# EAGLE design yBrainA1-11March2015 (EAGLE 7.2.0)
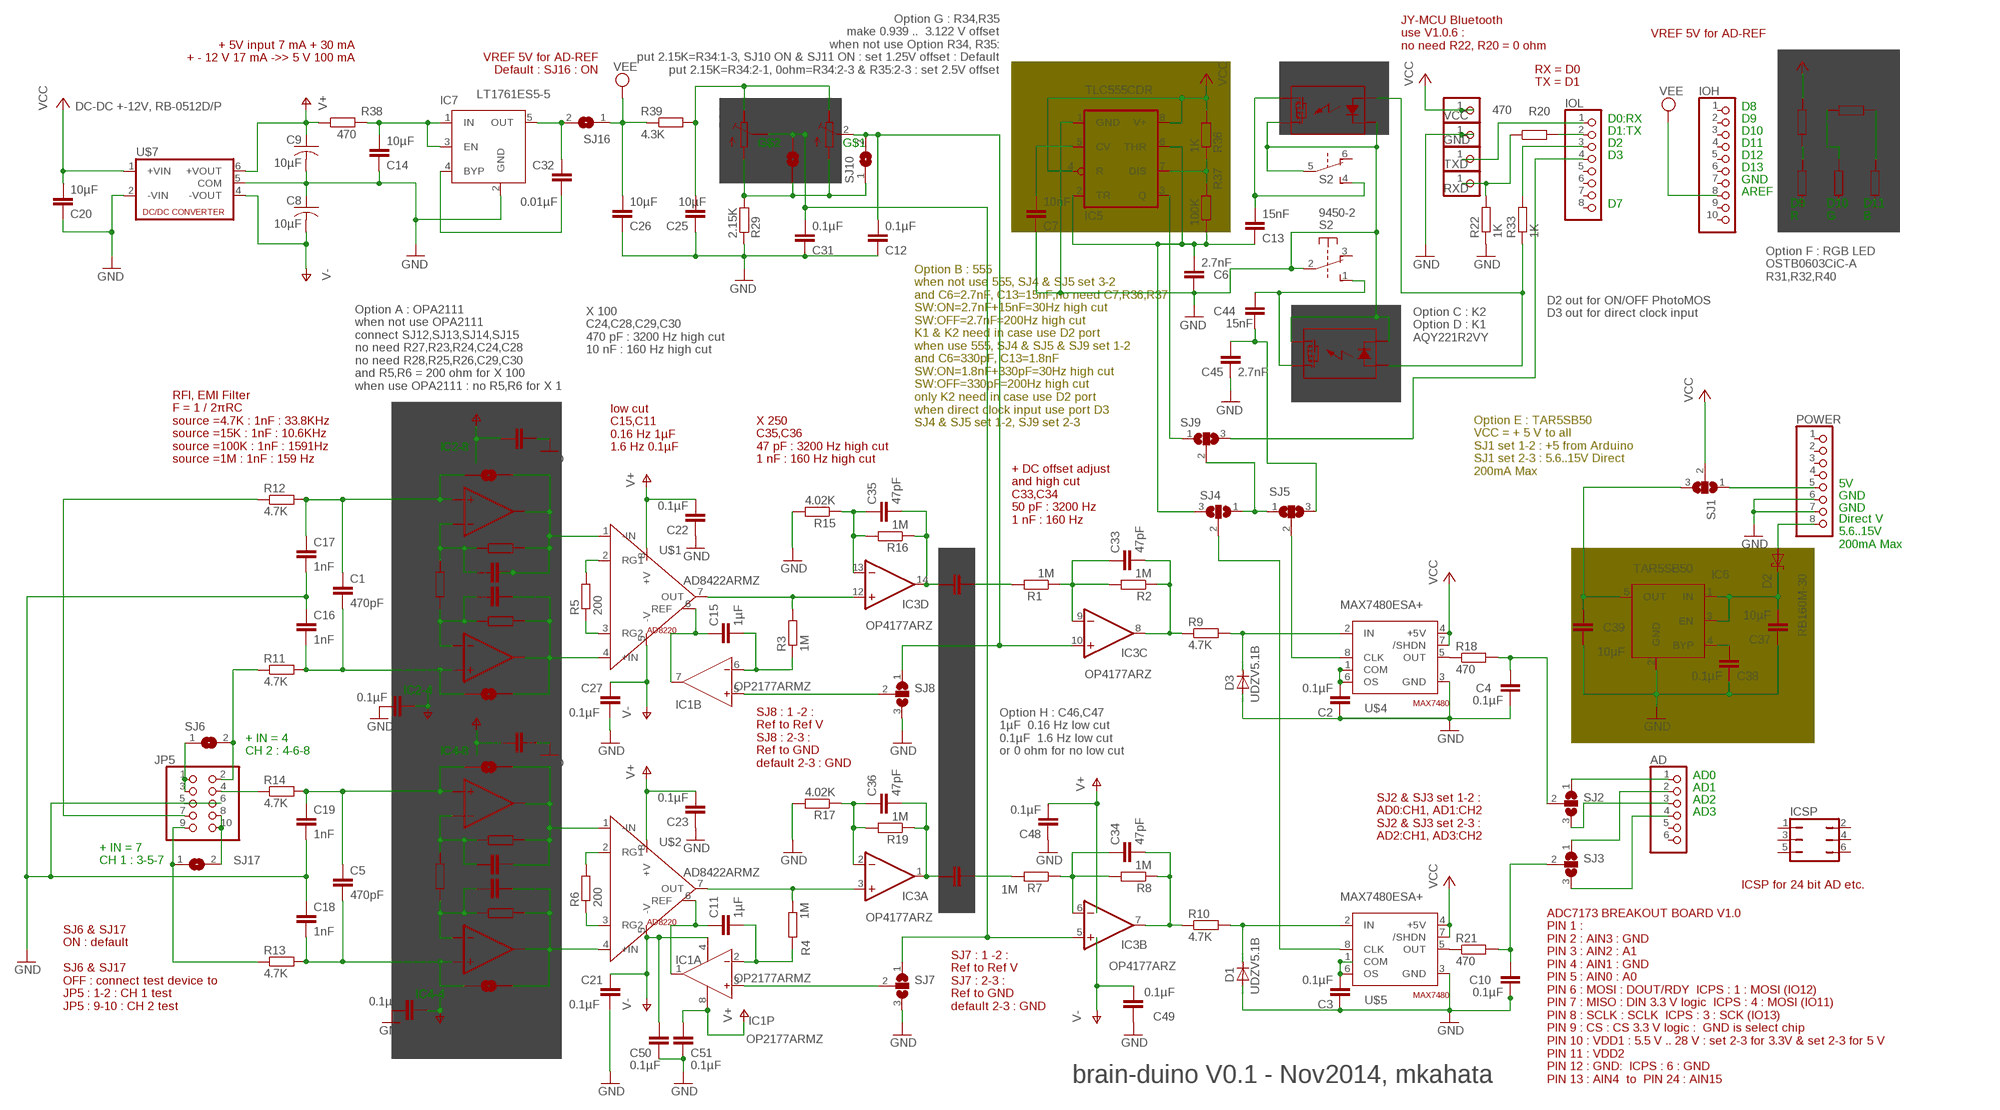
[diagram p0: schematic, sheet 1]

## Parts
AD  PINHD-1X6  [1X06]
C1  470pF  C-EUC0805  [C0805]
C2  0.1µF  C-EUC0805  [C0805]
C3  0.1µF  C-EUC0805  [C0805]
C4  0.1µF  C-EUC0805  [C0805]
C5  470pF  C-EUC0805  [C0805]
C6  2.7nF  C-EUC0805  [C0805]
C7  10nF  C-EUC0805  [C0805]
C8  10µF  C-USC0805  [C0805]
C9  10µF  C-USC0805  [C0805]
C10  0.1µF  C-EUC0805  [C0805]
C11  1µF  C-EUC0805  [C0805]
C12  0.1µF  C-EUC0805  [C0805]
C13  15nF  C-EUC0805  [C0805]
C14  10µF  C-EUC0805  [C0805]
C15  1µF  C-EUC0805  [C0805]
C16  1nF  C-EUC0805  [C0805]
C17  1nF  C-EUC0805  [C0805]
C18  1nF  C-EUC0805  [C0805]
C19  1nF  C-EUC0805  [C0805]
C20  10µF  C-EUC0805  [C0805]
C21  0.1µF  C-EUC0805  [C0805]
C22  0.1µF  C-EUC0805  [C0805]
C23  0.1µF  C-EUC0805  [C0805]
C24  470pF  C-EUC0805  [C0805]
C25  10µF  C-EUC0805  [C0805]
C26  10µF  C-EUC0805  [C0805]
C27  0.1µF  C-EUC0805  [C0805]
C28  470pF  C-EUC0805  [C0805]
C29  470pF  C-EUC0805  [C0805]
C30  470pF  C-EUC0805  [C0805]
C31  0.1µF  C-EUC0805  [C0805]
C32  0.01µF  C-EUC0805  [C0805]
C33  47pF  C-EUC0805  [C0805]
C34  47pF  C-EUC0805  [C0805]
C35  47pF  C-EUC0805  [C0805]
C36  47pF  C-EUC0805  [C0805]
C37  10µF  C-EUC0805  [C0805]
C38  0.1µF  C-EUC0805  [C0805]
C39  10µF  C-EUC0805  [C0805]
C40  0.1µF  C-EUC0805  [C0805]
C41  0.1µF  C-EUC0805  [C0805]
C42  0.1µF  C-EUC0805  [C0805]
C43  0.1µF  C-EUC0805  [C0805]
C44  15nF  C-EUC0805  [C0805]
C45  2.7nF  C-EUC0805  [C0805]
C46  1µF  C-EUC0805  [C0805]
C47  1µF  C-EUC0805  [C0805]
C48  0.1µF  C-EUC0805  [C0805]
C49  0.1µF  C-EUC0805  [C0805]
C50  0.1µF  C-EUC0805  [C0805]
C51  0.1µF  C-EUC0805  [C0805]
D1  UDZV5.1B  DIODE-SOD110-R  [SOD110-R]
D2  RB160M-30  PD3S160  [POWERDI323]
D3  UDZV5.1B  DIODE-SOD110-R  [SOD110-R]
GND  PINHD-1X1  [1X01]
IC1  OP2177ARMZ  AD8656RM  [MSOP08]
IC2  OPA2111KP  OPA2111P  [DIL08]
IC3  OP4177ARZ  TL064D  [SO14]
IC4  OPA2111KP  OPA2111P  [DIL08]
IC5  TLC555CDR  LM555D  [SO08]
IC6  TAR5SB50  MIC5219XX  [SOT23-5]
IC7  LT1761ES5-5  MIC5219XX  [SOT23-5]
ICSP  JP3Q  [JP3Q]
IOH  PINHD-1X10  [1X10]
IOL  PINHD-1X8  [1X08]
JP5  PINHD-2X5/90  [2X05/90]
K1  AQY221R2VY  AQY221R2V  [SSOP4]
K2  AQY221R2VY  AQY221R2V  [SSOP4]
POWER  PINHD-1X8  [1X08]
R1  1M  R-EU_R0805  [R0805]
R2  1M  R-EU_R0805  [R0805]
R3  1M  R-EU_R0805  [R0805]
R4  1M  R-EU_R0805  [R0805]
R5  200  R-EU_R0805  [R0805]
R6  200  R-EU_R0805  [R0805]
R7  1M  R-EU_R0805  [R0805]
R8  1M  R-EU_R0805  [R0805]
R9  4.7K  R-EU_R0805  [R0805]
R10  4.7K  R-EU_R0805  [R0805]
R11  4.7K  R-EU_R0805  [R0805]
R12  4.7K  R-EU_R0805  [R0805]
R13  4.7K  R-EU_R0805  [R0805]
R14  4.7K  R-EU_R0805  [R0805]
R15  4.02K  R-EU_R0805  [R0805]
R16  1M  R-EU_R0805  [R0805]
R17  4.02K  R-EU_R0805  [R0805]
R18  470  R-EU_R0805  [R0805]
R19  1M  R-EU_R0805  [R0805]
R20  470  R-EU_R0805  [R0805]
R21  470  R-EU_R0805  [R0805]
R22  1K  R-EU_R0805  [R0805]
R23  100K  R-EU_R0805  [R0805]
R24  100K  R-EU_R0805  [R0805]
R25  100K  R-EU_R0805  [R0805]
R26  100K  R-EU_R0805  [R0805]
R27  2K  R-EU_R0805  [R0805]
R28  2K  R-EU_R0805  [R0805]
R29  2.15K  R-EU_R0805  [R0805]
R30  LED  R-EU_R0402  [R0402]
R31  1K  R-EU_R0402  [R0402]
R32  1K  R-EU_R0402  [R0402]
R33  1K  R-EU_R0805  [R0805]
R34  10K  R-TRIMM5X  [RTRIM5X]
R35  10K  R-TRIMM5X  [RTRIM5X]
R36  1K  R-EU_R0805  [R0805]
R37  100K  R-EU_R0805  [R0805]
R38  470  R-EU_R0805  [R0805]
R39  4.3K  R-EU_R0805  [R0805]
R40  1K  R-EU_R0402  [R0402]
R41  LED  R-EU_R0402  [R0402]
RXD  PINHD-1X1  [1X01]
S2  9450-2  [9450-2]
SJ1  SJ2W  [SJ_2]
SJ2  SJ2W  [SJ_2]
SJ3  SJ2W  [SJ_2]
SJ4  SJ2W  [SJ_2]
SJ5  SJ2W  [SJ_2]
SJ6  SJ  [SJ]
SJ7  SJ2W  [SJ_2]
SJ8  SJ2W  [SJ_2]
SJ9  SJ2W  [SJ_2]
SJ10  SJ  [SJ]
SJ11  SJ  [SJ]
SJ12  SJ  [SJ]
SJ13  SJ  [SJ]
SJ14  SJ  [SJ]
SJ15  SJ  [SJ]
SJ16  SJ  [SJ]
SJ17  SJ  [SJ]
TXD  PINHD-1X1  [1X01]
U$1  AD8422ARMZ  AD8220  [AD8220]
U$2  AD8422ARMZ  AD8220  [AD8220]
U$4  MAX7480ESA+  MAX7480  [MAX7480]
U$5  MAX7480ESA+  MAX7480  [MAX7480]
U$7  DC-DC +-12V, RB-0512D/P  RB-0515D  [RB-0515D]
VCC  PINHD-1X1  [1X01]

## Nets
GND: C2.1 C3.1 C4.1 C6.1 C7.1 C8.1 C9.2 C10.1 C12.1 C14.1 C16.1 C17.2 C18.1 C19.2 C20.1 C21.2 C22.1 C23.1 C25.1 C26.1 C27.2 C31.1 C37.1 C38.1 C39.1 C40.1 C41.2 C42.2 C43.2 C45.1 C48.1 C49.1 C50.2 C51.2 D1.A D3.A GND.1 IC5.1(GND) IC6.2(GND) IC7.2(GND) JP5.5 JP5.6 K1.2(K) K1.3(DS2) K2.2(K) K2.3(DS2) POWER.6 POWER.7 R15.2 R17.2 R22.1 R29.1 S2.2(1:P) S2.5(2:P) SJ7.3 SJ8.3 U$4.3(GND) U$5.3(GND) U$7.2(-VIN) U$7.5(COM)
N$1: C4.2 R18.2 SJ2.2
N$2: C34.2 IC3.7(B:OUT) R8.1 R10.1
N$3: C47.2 R7.2
N$5: C15.2 IC1.6(B:IN-) R3.1
N$6: C24.1 IC2.2(A:-IN) R23.1 R27.2
N$7: C33.1 IC3.9(C:-IN) R1.1 R2.2
N$8: C34.1 IC3.6(B:-IN) R7.1 R8.2
N$9: D3.C R9.2 U$4.2(IN)
N$10: C10.2 R21.2 SJ3.2
N$12: D1.C R10.2 U$5.2(IN)
N$13: C28.1 IC2.6(B:-IN) R24.1 R27.1
N$14: IC3.12(D:+IN) R3.2 U$1.7(OUT)
N$15: R20.1 R22.2 RXD.1
N$16: C24.2 IC2.1(A:OUT) R23.2 SJ12.1 U$1.1(-IN)
N$17: C15.1 IC1.7(B:OUT) U$1.6(REF)
N$18: C11.1 IC1.1(A:OUT) U$2.6(REF)
N$19: C11.2 IC1.2(A:IN-) R4.1
N$20: C35.1 IC3.13(D:-IN) R15.1 R16.2
N$21: R5.1 U$1.3(RG2)
N$22: C1.2 C16.2 IC2.5(B:+IN) R11.2 SJ13.2
N$24: C28.2 IC2.7(B:OUT) R24.2 SJ13.1 U$1.4(+IN)
N$25: C5.1 C19.1 IC4.3(A:+IN) R14.2 SJ14.2
N$26: C13.2 K2.4(DS1) S2.4(2:S)
N$27: C35.2 C46.1 IC3.14(D:OUT) R16.1
N$28: JP5.8 JP5.10 SJ17.2
N$29: C5.2 C18.2 IC4.5(B:+IN) R13.2 SJ15.2
N$30: C36.1 IC3.2(A:-IN) R17.1 R19.2
N$32: C36.2 C47.1 IC3.1(A:OUT) R19.1
N$33: IOL.2 R20.2
N$34: R5.2 U$1.2(RG1)
N$35: IOL.1 TXD.1
N$36: C33.2 IC3.8(C:OUT) R2.1 R9.1
N$37: JP5.7 R12.1
N$38: AD.1 SJ2.1
N$39: C2.2 U$4.1(COM) U$4.6(OS)
N$40: C29.1 IC4.2(A:-IN) R25.1 R28.2
N$41: C3.2 U$5.1(COM) U$5.6(OS)
N$42: C30.1 IC4.6(B:-IN) R26.1 R28.1
N$43: C29.2 IC4.1(A:OUT) R25.2 SJ14.1 U$2.1(-IN)
N$44: R6.2 U$2.2(RG1)
N$45: C30.2 IC4.7(B:OUT) R26.2 SJ15.1 U$2.4(+IN)
N$46: R18.1 U$4.5(OUT)
N$47: AD.2 SJ3.1
N$48: AD.3 SJ2.3
N$49: AD.4 SJ3.3
N$50: IC3.3(A:+IN) R4.2 U$2.7(OUT)
N$51: C38.2 IC6.4(BYP)
N$52: JP5.2 R11.1 SJ6.2
N$53: IOL.3 R33.2
N$54: R6.1 U$2.3(RG2)
N$55: C1.1 C17.1 IC2.3(A:+IN) R12.2 SJ12.2
N$56: C14.2 IC7.1(IN) IC7.3(EN) R38.2
N$57: R21.1 U$5.5(OUT)
N$59: C37.2 D2.C IC6.1(IN) IC6.3(EN)
N$65: C31.2 IC3.5(B:+IN) R34.2(S) SJ7.1 SJ11.2
N$74: K1.1(A) K2.1(A) R33.1
N$75: C25.2 R34.3(A) R35.3(A) R39.2
N$77: JP5.1 JP5.3 SJ6.1
N$78: IC5.7(DIS) R36.1 R37.2
N$80: C6.2 C13.1 IC5.2(TR) IC5.6(THR) R37.1 SJ4.3
N$81: JP5.9 R13.1 SJ17.1
N$82: C32.1 IC7.4(BYP)
N$83: C7.2 IC5.5(CV)
N$84: C39.2 IC6.5(OUT) SJ1.3
N$85: POWER.5 SJ1.1
N$90: R29.2 R34.1(E) R35.1(E) SJ10.1 SJ11.1
N$91: SJ5.2 U$4.8(CLK)
N$92: SJ4.2 U$5.8(CLK)
N$94: IC5.3(Q) SJ9.1
N$95: C44.1 C45.2 SJ5.3
N$97: C44.2 K1.4(DS1) S2.1(1:S)
N$99: R31.2 R41.1
N$100: R30.2 R32.2
N$101: R30.1 R40.2
N$102: C46.2 R1.2
N$103: D2.A POWER.8
N$104: IC1.5(B:IN+) SJ8.2
N$107: C12.2 IC3.10(C:+IN) R35.2(S) SJ8.1 SJ10.2
N$108: IC1.3(A:IN+) SJ7.2
N$109: SJ4.1 SJ5.1 SJ9.2
N$113: IOL.4 SJ9.3
N$114: JP5.4 R14.1
N$119: C32.2 IC7.5(OUT) SJ16.2
V+: C9.1 C22.2 C23.2 C40.2 C42.1 C48.2 C51.1 IC1.8(P:V+) R38.1 U$1.8(+V) U$2.8(+V) U$7.6(+VOUT)
V-: C8.2 C21.1 C27.1 C41.1 C43.1 C49.2 C50.1 IC1.4(P:V-) U$1.5(-V) U$2.5(-V) U$7.4(-VOUT)
VCC: C20.2 IC5.4(R) IC5.8(V+) R36.2 R41.2 SJ1.2 U$4.4(+5V) U$4.7(/SHDN) U$5.4(+5V) U$5.7(/SHDN) U$7.1(+VIN) VCC.1
VEE: C26.2 IOH.8 R39.1 SJ16.1
Unconnected: AD.5 AD.6 ICSP.1 ICSP.2 ICSP.3 ICSP.4 ICSP.5 ICSP.6 IOH.1 IOH.2 IOH.3 IOH.4 IOH.5 IOH.6 IOH.7 IOH.9 IOH.10 IOL.5 IOL.6 IOL.7 IOL.8 POWER.1 POWER.2 POWER.3 POWER.4 R31.1 R32.1 R40.1 S2.3(1:O) S2.6(2:O)

## Notes on the sheet
- VREF 5V for AD-REF
- JY-MCU Bluetooth
  use V1.0.6 :
  no need R22, R20 = 0 ohm
- + 5V input 7 mA + 30 mA
  + - 12 V 17 mA ->> 5 V 100 mA
- VREF 5V for AD-REF
  Default : SJ16 : ON
- Option G : R34,R35
  make 0.939 ..  3.122 V offset
  when not use Option R34, R35:
  put 2.15K=R34:1-3, SJ10 ON & SJ11 ON : set 1.25V offset : Default
  put 2.15K=R34:2-1, 0ohm=R34:2-3 & R35:2-3 : set 2.5V offset
- RX = D0
  TX = D1
- D8
- D0:RX | D9
- D1:TX | D10
- G$2 | G$1 | D2 | D11
- D3 | D12
- D13
- GND
- AREF
- D7
- D9
  R
- D10
  G
- D11
  B
- Option F : RGB LED
  OSTB0603CiC-A
  R31,R32,R40
- D2 out for ON/OFF PhotoMOS
  D3 out for direct clock input
- Option C : K2
  Option D : K1
  AQY221R2VY
- X 100
  C24,C28,C29,C30
  470 pF : 3200 Hz high cut
  10 nF : 160 Hz high cut
- Option A : OPA2111
  when not use OPA2111
  connect SJ12,SJ13,SJ14,SJ15
  no need R27,R23,R24,C24,C28
  no need R28,R25,R26,C29,C30
  and R5,R6 = 200 ohm for X 100
  when use OPA2111 : no R5,R6 for X 1
- Option B : 555
  when not use 555, SJ4 & SJ5 set 3-2
  and C6=2.7nF, C13=15nF,no need C7,R36,R37
  SW:ON=2.7nF+15nF=30Hz high cut
  SW:OFF=2.7nF=200Hz high cut
  K1 & K2 need in case use D2 port
  when use 555, SJ4 & SJ5 & SJ9 set 1-2
  and C6=330pF, C13=1.8nF
  SW:ON=1.8nF+330pF=30Hz high cut
  SW:OFF=330pF=200Hz high cut
  only K2 need in case use D2 port
  when direct clock input use port D3
  SJ4 & SJ5 set 1-2, SJ9 set 2-3
- IC2-8
- low cut
  C15,C11
  0.16 Hz 1µF
  1.6 Hz 0.1µF
- RFI, EMI Filter
  F = 1 / 2πRC
  source =4.7K : 1nF : 33.8KHz
  source =15K : 1nF : 10.6KHz
  source =100K : 1nF : 1591Hz
  source =1M : 1nF : 159 Hz
- X 250
  C35,C36
  47 pF : 3200 Hz high cut
  1 nF : 160 Hz high cut
- Option E : TAR5SB50
  VCC = + 5 V to all
  SJ1 set 1-2 : +5 from Arduino
  SJ1 set 2-3 : 5.6..15V Direct
  200mA Max
- 5V
- GND
- GND
- + DC offset adjust
  and high cut
  C33,C34
  50 pF : 3200 Hz
  1 nF : 160 Hz
- Direct V
  5.6..15V
  200mA Max
- IC2-4
- + IN = 4
  CH 2 : 4-6-8
- IC4-8
- Option H : C46,C47
  1µF  0.16 Hz low cut
  0.1µF  1.6 Hz low cut
  or 0 ohm for no low cut
- SJ8 : 1 -2 : 
  Ref to Ref V
  SJ8 : 2-3 : 
  Ref to GND
  default 2-3 : GND
- AD0
- AD1
- AD2
- AD3
- SJ2 & SJ3 set 1-2 : 
  AD0:CH1, AD1:CH2
  SJ2 & SJ3 set 2-3 : 
  AD2:CH1, AD3:CH2
- + IN = 7
  CH 1 : 3-5-7
- ICSP for 24 bit AD etc.
- IC4-4
- SJ6 & SJ17
  ON : default
  
  SJ6 & SJ17
  OFF : connect test device to
  JP5 : 1-2 : CH 1 test
  JP5 : 9-10 : CH 2 test
- SJ7 : 1 -2 : 
  Ref to Ref V
  SJ7 : 2-3 : 
  Ref to GND
  default 2-3 : GND
- brain-duino V0.1 - Nov2014, mkahata
- ADC7173 BREAKOUT BOARD V1.0
  PIN 1 : 
  PIN 2 : AIN3 : GND
  PIN 3 : AIN2 : A1
  PIN 4 : AIN1 : GND
  PIN 5 : AIN0 : A0
  PIN 6 : MOSI : DOUT/RDY  ICPS : 1 : MOSI (IO12)
  PIN 7 : MISO : DIN 3.3 V logic  ICPS : 4 : MOSI (IO11)
  PIN 8 : SCLK : SCLK  ICPS : 3 : SCK (IO13)
  PIN 9 : CS : CS 3.3 V logic :  GND is select chip
  PIN 10 : VDD1 : 5.5 V .. 28 V : set 2-3 for 3.3V & set 2-3 for 5 V
  PIN 11 : VDD2
  PIN 12 : GND:  ICPS : 6 : GND
  PIN 13 : AIN4  to  PIN 24 : AIN15

## Power pins joined to a net without a drawn wire
V+: IC2.8(P:V+) IC3.4(P:V+) IC4.8(P:V+)
V-: IC2.4(P:V-) IC3.11(P:V-) IC4.4(P:V-)

## Library data of the parts
AD = pinhead:PINHD-1X6: PIN HEADER
C1-C7 C10-C51 = rcl:C-EU: CAPACITOR, European symbol
C8 C9 = rcl:C-US: CAPACITOR, American symbol
D1 D3 = diode:DIODE-: DIODE
D2 = diode:PD3S160: 1.0A SURFACE MOUNT SCHOTTKY BARRIER RECTIFIER POWERDI ® 323 Source: http://www.diodes.com/datasheets/ds30899.pdf
GND RXD TXD VCC = pinhead:PINHD-1X1: PIN HEADER
IC1 = analog-devices:AD8656: Low Noise, Precision CMOS Amplifier Source: http://www.analog.com/static/imported-files/data_sheets/AD8655_8656.pdf; MPN: AD8656ARMZ; OC_FARNELL: 1117887; OC_NEWARK: 34P3252
IC2 IC4 = linear:OPA2111: OP AMP
IC3 = linear:TL064: OP AMP
IC5 = linear:*555: TIMER
IC6 IC7 = v-reg-micrel:MIC5219XX: VOLTAGE REGULATOR; OC_FARNELL: unknown; OC_NEWARK: unknown
ICSP = jumper:JP3Q: JUMPER
IOH = pinhead:PINHD-1X10: PIN HEADER
IOL POWER = pinhead:PINHD-1X8: PIN HEADER
JP5 = pinhead:PINHD-2X5: PIN HEADER
K1 K2 = relay:AQY221*2V: PHOTOMOS Relay RF (Radio Frequency) NAiS C . R 10 SSOP Type; Source: http://www.mew-europe.com/.. aqy221_2v.pdf; MF: AROMAT/ MATSUSHITA; MPN: AQY221R2V; OC_FARNELL: 1839014; OC_NEWARK: 94C1062
R1-R33 R36-R41 = rcl:R-EU_: RESISTOR, European symbol
R34 R35 = resistor:R-TRIMM: Trimm resistor
S2 = switch-misc:9450-2: MARQUARDT SWITCH
SJ1-SJ5 SJ7-SJ9 = jumper:SJ2W: SMD solder JUMPER
SJ6 SJ10-SJ17 = jumper:SJ: SMD solder JUMPER
U$1 U$2 = MKH:AD8220: IN-AMP{
U$4 U$5 = MKH:MAX7480: Switched-Capacitor Filter
U$7 = MKH:RB-0515D: 1kVDC / 2kVDC Isolation DC-DC Converter

## Net classes
0 default: clearance 0.205 mm

## Board
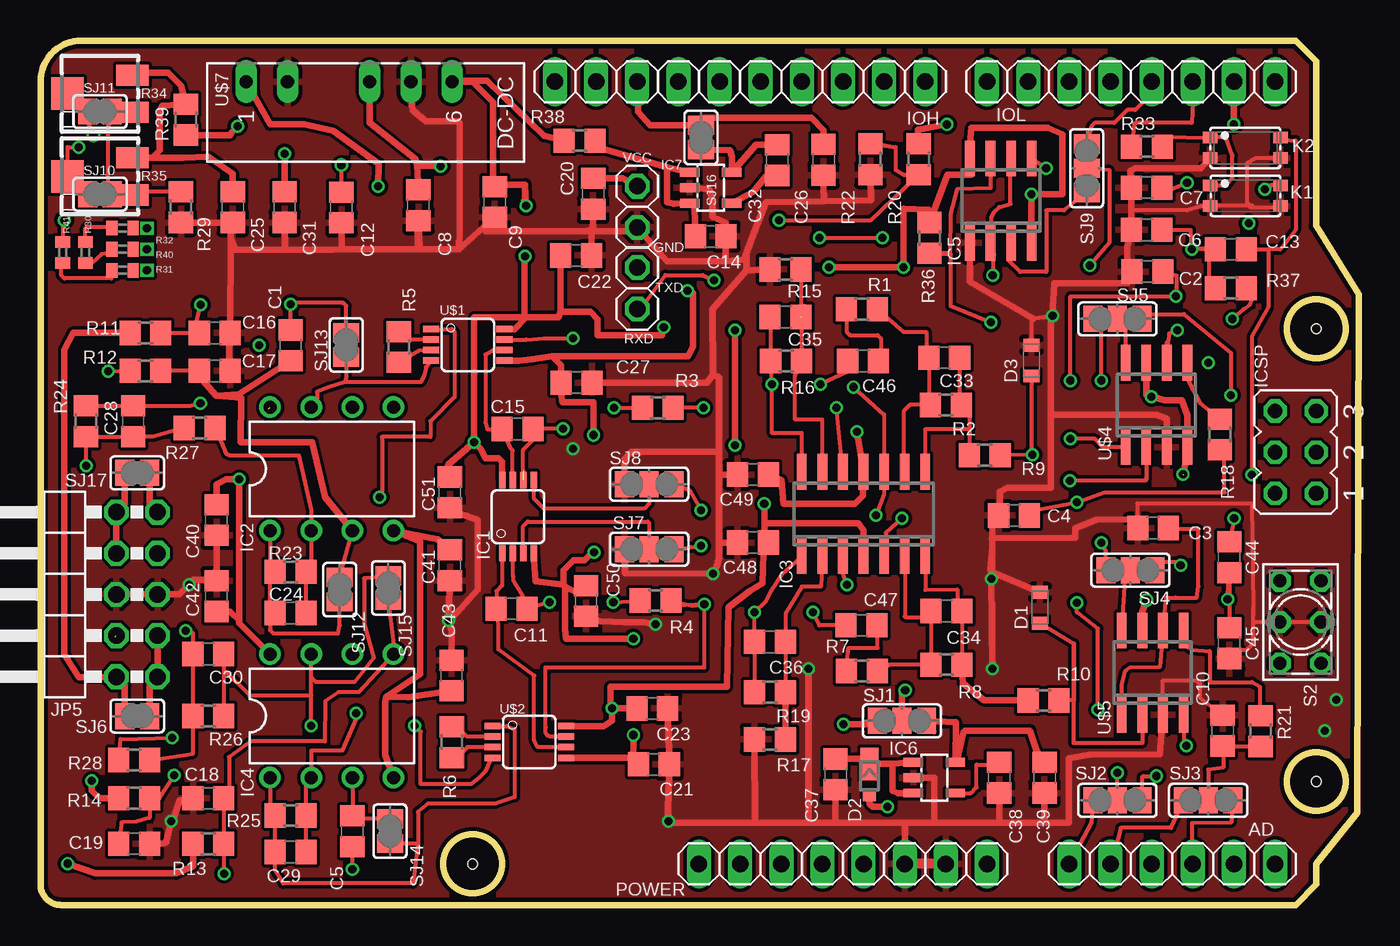
[diagram p1: board, top side]
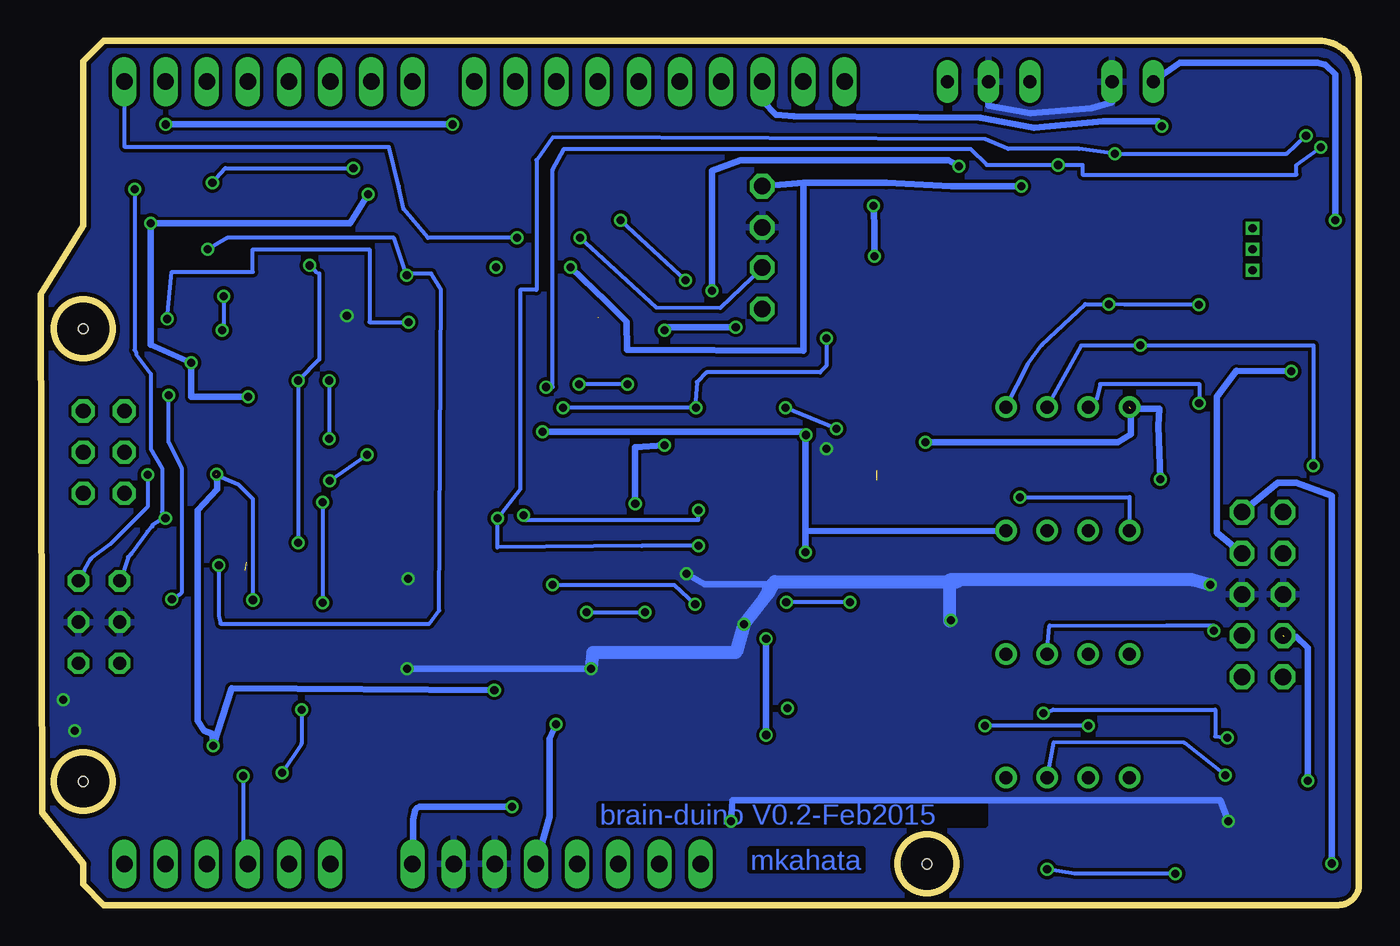
[diagram p2: board, bottom side, seen from below]

Size 81.38 x 53.34 mm. Coordinates in mm from the lower left corner, seen from the top.
Outline: 0,1.27 0,50.8 arc-90 2.54,53.34 77.47,53.34 78.74,52.07 78.74,41.91 81.38,37.7 81.28,5.68 78.74,2.54 78.74,1.27 77.47,0 1.27,0 arc-90 0,1.27
Outline: circle at 78.74,35.56 radius 1.8
Outline: circle at 78.74,7.62 radius 1.8
Outline: circle at 26.67,2.54 radius 1.8
Copper layers (1*16): Top 0.035mm / dielectric 1.5mm / Bottom 0.035mm
Design rules "BrainA1-n3 *": minimum track width 5mil, minimum drill 12mil, track to track 0.205mm, track to pad 0.205mm, pad to pad 0.205mm, via to via 0.205mm, smd to smd 0mil, copper to edge 10mil, drill to drill 10mil, minimum pad ring 10mil, minimum via ring 6mil, stop-mask expansion 2mil, vias tented up to drill 25mil, thermal gap 10mil
Holes 0.6 mm at 78.74,35.56 78.74,7.62 26.67,2.54

### Footprints (pad centres in the part's own frame; a part is rotated, then mirrored left to right if it is on the bottom)
1X06 = drill 1.016 long: 1 -6.35,0; 2 -3.81,0; 3 -1.27,0; 4 1.27,0; 5 3.81,0; 6 6.35,0
C0805 = smd 1.3 x 1.5: 1 -0.95,0; 2 0.95,0
SOD110-R = smd 0.8 x 1: A 0.95,0; C -0.95,0
POWERDI323 = smd 0.8 x 0.8: A 1.15,0 | smd 2 x 1.1: C -0.75,0
1X01 = drill 1.016 octagon: 1 0,0
MSOP08 = smd 0.4 x 1: 1 -0.976,-2.263; 2 -0.326,-2.263; 3 0.324,-2.263; 4 0.974,-2.263; 5 0.974,2.262; 6 0.324,2.262; 7 -0.326,2.262; 8 -0.976,2.262
DIL08 = drill 0.813 pad 1.27: 1 -3.81,-3.81; 2 -1.27,-3.81; 3 1.27,-3.81; 4 3.81,-3.81; 5 3.81,3.81; 6 1.27,3.81; 7 -1.27,3.81; 8 -3.81,3.81
SO14 = smd 0.6 x 2.2: 1 -3.81,-2.6; 2 -2.54,-2.6; 3 -1.27,-2.6; 4 0,-2.6; 5 1.27,-2.6; 6 2.54,-2.6; 7 3.81,-2.6; 8 3.81,2.6; 9 2.54,2.6; 10 1.27,2.6; 11 0,2.6; 12 -1.27,2.6; 13 -2.54,2.6; 14 -3.81,2.6
SO08 = smd 0.6 x 2.2: 1 -1.905,-2.6; 2 -0.635,-2.6; 3 0.635,-2.6; 4 1.905,-2.6; 5 1.905,2.6; 6 0.635,2.6; 7 -0.635,2.6; 8 -1.905,2.6
SOT23-5 = smd 0.55 x 1.2: 1 -0.95,-1.3; 2 0,-1.3; 3 0.95,-1.3; 4 0.95,1.3; 5 -0.95,1.3
JP3Q = drill 0.914 octagon: 1 -2.54,-1.27; 2 -2.54,1.27; 3 0,-1.27; 4 0,1.27; 5 2.54,-1.27; 6 2.54,1.27
1X10 = drill 1.016 long: 1 -11.43,0; 2 -8.89,0; 3 -6.35,0; 4 -3.81,0; 5 -1.27,0; 6 1.27,0; 7 3.81,0; 8 6.35,0; 9 8.89,0; 10 11.43,0
1X08 = drill 1.016 long: 1 -8.89,0; 2 -6.35,0; 3 -3.81,0; 4 -1.27,0; 5 1.27,0; 6 3.81,0; 7 6.35,0; 8 8.89,0
2X05/90 = drill 1.016 octagon: 1 -5.08,-6.35; 2 -5.08,-3.81; 3 -2.54,-6.35; 4 -2.54,-3.81; 5 0,-6.35; 6 0,-3.81; 7 2.54,-6.35; 8 2.54,-3.81; 9 5.08,-6.35; 10 5.08,-3.81
SSOP4 = smd 0.9 x 0.7: 1 -2.175,0.635; 2 -2.175,-0.635; 3 2.175,-0.635; 4 2.175,0.635
R0805 = smd 1.3 x 1.5: 1 -0.95,0; 2 0.95,0
R0402 = smd 0.7 x 0.9: 1 -0.65,0; 2 0.65,0
RTRIM5X = smd 1.3 x 2: 1 -1.15,-2; 3 1.15,-2 | smd 2 x 2: 2 0,2
9450-2 = drill 0.813 octagon: 1 -2.54,-1.27; 2 0,-1.27; 3 2.54,-1.27; 4 -2.54,1.27; 5 0,1.27; 6 2.54,1.27
SJ_2 = smd 1.168 x 1.6: 1 -1.524,0; 2 0,0; 3 1.524,0
SJ = smd 1.168 x 1.6: 1 -0.762,0; 2 0.762,0
AD8220 = smd 0.4 x 1: 1 -0.976,-2.263; 2 -0.326,-2.263; 3 0.324,-2.263; 4 0.974,-2.263; 5 0.974,2.262; 6 0.324,2.262; 7 -0.326,2.262; 8 -0.976,2.262
MAX7480 = smd 0.6 x 2.2: 1 -1.905,-2.6; 2 -0.635,-2.6; 3 0.635,-2.6; 4 1.905,-2.6; 5 1.905,2.6; 6 0.635,2.6; 7 -0.635,2.6; 8 -1.905,2.6
RB-0515D = drill 0.813 long: 1 1.27,6.35; 2 1.27,3.81; 4 1.27,-1.27; 5 1.27,-3.81; 6 1.27,-6.35

### Placement (x,y rotation side)
AD  69.85,2.54 0 top
C1  15.44,34.53 90 top
C2  68.32,39.08 0 top
C3  68.67,23.26 0 top
C4  60.09,24.04 0 top
C5  19.25,4.55 270 top
C6  68.27,41.66 0 top
C7  68.27,44.26 0 top
C8  23.33,43.18 90 top
C9  28.04,43.38 270 top
C10  72.96,10.76 270 top
C11  29.07,18.28 0 top
C12  18.58,43.04 90 top
C13  73.47,40.46 0 top
C14  41.37,41.26 180 top
C15  29.44,29.38 0 top
C16  10.76,35.3 180 top
C17  10.76,32.96 0 top
C18  10.36,6.59 0 top
C19  5.78,3.78 0 top
C20  34.11,43.88 90 top
C21  37.86,8.68 0 top
C22  33.05,40.08 180 top
C23  37.76,12.13 180 top
C24  15.44,18.02 180 top
C25  11.87,43.06 90 top
C26  48.33,45.98 90 top
C27  33.08,32.23 0 top
C28  5.72,29.85 90 top
C29  15.44,3.28 180 top
C30  10.36,15.48 0 top
C31  15.07,43.06 90 top
C32  45.47,45.96 90 top
C33  55.78,33.77 0 top
C34  55.91,18.14 0 top
C35  45.98,36.28 180 top
C36  45.02,16.24 180 top
C37  49.07,8.06 90 top
C38  59.17,7.86 90 top
C39  61.97,7.86 90 top
C40  10.87,23.76 90 top
C41  25.27,20.96 270 top
C42  10.87,19.06 90 top
C43  25.37,14.16 90 top
C44  73.37,21.46 90 top
C45  73.37,16.16 90 top
C46  50.77,33.56 0 top
C47  50.67,17.26 0 top
C48  43.97,22.36 0 top
C49  43.97,26.56 0 top
C50  33.67,18.76 270 top
C51  25.27,25.46 270 top
D1  61.69,18.34 90 top
D2  51.17,7.96 270 top
D3  61.16,33.59 90 top
GND  36.83,41.81 0 top
IC1  29.47,23.96 0 top
IC2  17.98,26.91 0 top
IC3  50.8,24.13 0 top
IC4  17.98,11.67 0 top
IC5  59.27,43.46 0 top
IC6  55.17,7.86 270 top
IC7  41.37,44.26 270 top
ICSP  77.47,27.94 90 top
IOH  43.18,50.8 180 top
IOL  67.31,50.8 180 top
JP5  0.87,19.16 90 top
K1  74.37,43.76 0 top
K2  74.36,46.72 0 top
POWER  49.53,2.54 0 top
R1  50.7,36.76 180 top
R2  55.88,30.86 180 top
R3  38.1,30.68 0 top
R4  37.96,18.78 0 top
R5  22.12,34.43 90 top
R6  25.39,10.05 90 top
R7  50.7,14.44 180 top
R8  55.91,14.83 180 top
R9  58.28,27.75 0 top
R10  61.91,12.62 0 top
R11  6.48,35.3 0 top
R12  6.48,32.96 0 top
R13  10.36,3.78 0 top
R14  5.78,6.59 0 top
R15  45.98,39.22 180 top
R16  46.02,33.56 0 top
R17  45.02,10.22 180 top
R18  72.79,29.03 270 top
R19  45.02,13.13 0 top
R20  54.2,46.02 90 top
R21  75.3,10.73 270 top
R22  51.22,46.02 90 top
R23  15.44,20.56 180 top
R24  2.81,29.85 90 top
R25  15.44,5.52 180 top
R26  10.36,11.67 0 top
R27  9.82,29.44 0 top
R28  5.78,8.94 180 top
R29  8.67,43.06 90 top
R30  2.77,40.26 90 top
R31  5.07,39.16 180 top
R32  5.07,41.76 180 top
R33  68.28,46.79 180 top
R34  3.67,50.06 90 top
R35  3.67,44.96 90 top
R36  54.87,41.16 90 top
R37  73.47,38.06 0 top
R38  33.27,47.16 0 top
R39  8.97,48.46 90 top
R40  5.07,40.46 180 top
R41  1.37,40.26 90 top
RXD  36.83,36.77 0 top
S2  77.77,17.46 270 top
SJ1  53.17,11.36 0 top
SJ2  66.47,6.46 0 top
SJ3  72.07,6.46 0 top
SJ4  67.27,20.66 0 top
SJ5  66.47,36.16 0 top
SJ6  5.97,11.66 180 top
SJ7  37.57,21.96 180 top
SJ8  37.57,25.96 180 top
SJ9  64.57,45.46 90 top
SJ10  3.67,43.86 180 top
SJ11  3.67,48.96 180 top
SJ12  18.47,19.46 90 top
SJ13  18.87,34.56 90 top
SJ14  21.57,4.56 90 top
SJ15  21.47,19.56 270 top
SJ16  40.77,47.36 270 top
SJ17  5.97,26.66 180 top
TXD  36.83,39.33 0 top
U$1  26.37,34.56 270 top
U$2  30.17,10.06 270 top
U$4  68.88,30.86 0 top
U$5  68.64,14.34 0 top
U$7  19.05,49.53 90 top
VCC  36.83,44.35 0 top

### Tracks (layer width: path | path; a pad name or v marks a point on that pad's centre or on a via)
GND  (via drill 0.5)
  Top 0.254: 9.09,6.59 C18.1 9.37,6.55 | 58.74,22.02 58.72,23.44 C4.1 | 11.63,35.48 C16.1 | 11.63,33.58 C17.2 | v62.47,36.36 61.27,36.16 | 61.27,36.16 61.17,36.1 D3.A | 62.37,36.26 61.27,36.16 | 67.07,38.36 67.25,38.66 C2.1 | IC5.1 57.57,41.06 57.57,41.16 | 25.87,48.26 25.77,48.36 | 23.77,48.36 23.67,48.46 | 15.09,40.43 15.15,40.43 | 18.58,40.53 18.07,40.42 | 67.73,23.29 67.7,24.76 74.77,24.76 74.86,18.36 | 58.77,22.53 58.64,20.66 | U$5.3 69.28,13.87 70.27,13.86 71.27,13.86 71.57,13.66 71.57,12.8 C10.1 73.17,11.92 | 67.32,42.86 70.77,42.86 71.63,43.12 K1.2 72.33,43.16 74.47,43.16 74.47,43.36 | 72.09,45.94 72.19,46.03 K2.2 | 74.86,18.36 74.87,17.89 | C45.1 73.37,15.76 74.47,15.76 74.87,16.16 74.87,17.36 | 24.82,19.46 C41.2 | K2.3 75,46.09 74.47,45.76 74.47,43.36 | 74.47,43.36 74.77,43.16 74.67,43.06 76.58,43.06 K1.3 | 74.87,17.36 74.87,18.35 74.86,18.36 | S2.5 S2.2 74.97,17.46 74.87,17.36 | 38.59,5.26 38.77,5.08 | 34,41.49 34.07,41.56 | 25.17,17.59 v25.2,17.56
  Top 0.305: 11.66,42.01 11.64,41.93
  Top 0.406: R17.2 44.11,5.12 38.71,5.08 | 38.71,5.08 C21.2 C23.1 | 61.97,5.08 63.46,5.08 63.46,9.06 64.74,9.26 69.07,9.29 U$5.3 | 61.97,5.08 59.17,5.08 | 59.17,5.08 55.17,5.08 | 55.17,5.08 53.34,5.08 | 53.34,5.08 49.07,5.08 | 49.07,5.08 47.4,5.08 | 47.4,5.08 38.77,5.08 38.71,5.08 | POWER.6 53.34,5.08 | D1.A 58.75,20.54 v58.69,20.14 | v58.69,20.14 v58.75,14.59 | C4.1 59.22,24.66 59.22,25.51 59.67,25.76 62.37,25.76 62.37,30.26 | v58.69,20.14 58.75,21.79 58.74,23.18 58.74,22.02 58.64,20.66 | 23.4,40.46 25.84,40.46 | 25.84,40.46 C9.2 27.5,42.23 27.47,41.56 33.67,41.56 | v47.4,14.59 47.4,5.08 | C3.1 67.73,23.29 67.44,23.79 65.17,23.76 63.87,23.26 63.87,22.66 63.62,22.65 58.73,22.63 58.77,22.53 | 11.73,41.16 12.03,40.42 15.08,40.42 C31.1 | 11.73,41.16 C16.1 | 11.63,35.48 11.63,33.58 | 23.4,40.46 C8.1 23.27,41.83 23.27,40.56 | C31.1 15.09,40.43 18.07,40.42 18.67,40.46 23.27,40.46 | C31.1 15.11,42.11 | 11.64,41.93 11.57,41.96 | IC5.1 57.37,38.46 61.27,36.16 | 62.37,30.26 62.37,30.46 | 62.37,30.46 62.37,36.26 | U$4.3 69.51,30 68.87,30.26 62.37,30.26 | 62.37,30.26 62.47,30.16 62.37,30.46 | 41.87,27.96 41.87,32.56 41.51,32.71 | 41.87,27.96 41.87,26.56 | 41.87,26.56 41.87,22.36 | 41.87,22.36 41.87,21.36 41.73,20.86 v41.5,20.43 36.07,20.46 SJ7.3 | 41.51,32.71 41.47,36.76 43.57,39.16 | 43.57,39.16 43.97,39.16 R15.2 | 42.27,39.71 38.67,39.71 GND.1 36.68,41.76 36.17,41.56 34.07,41.56 33.67,41.56 | 42.27,39.71 43.42,39.81 | 43.42,39.81 43.97,41.31 44.77,43.36 48.36,43.41 | 43.42,39.81 43.57,40.16 43.57,39.16 | R22.1 51.27,43.47 48.36,43.41 | 72.13,45.98 72.09,45.94 71.61,45.46 67.57,45.46 67.27,45.31 C7.1 67.32,42.86 C6.1 67.07,40.61 67.07,38.36 62.57,38.36 v62.47,36.36
  Top 0.406: 23.4,40.46 23.27,40.56 | 23.27,40.56 23.27,40.46 | 23.4,40.46 23.27,40.46 | 23.4,40.56 23.4,40.46 | 25.87,48.26 25.87,41.64 25.84,40.46 | 25.77,48.36 23.77,48.36 | 23.67,48.46 22.97,49.05 22.86,49.96 U$7.5 | 42.27,39.71 C14.1 42.27,42.11 41.47,42.46 41.47,43.26 41.37,43.86 41.27,44.16 IC7.2 | C12.1 18.58,40.53 | C25.1 11.66,42.01 | C25.1 11.78,41.91 11.73,41.16 | C26.1 48.33,44.44 48.36,43.41 | C20.1 34.11,41.72 33.67,41.56 | C37.1 49.07,5.08 | IC6.2 55.17,7.86 55.17,5.08 | C39.1 61.97,5.08 | v25.2,17.56 25.4,16.79 | C43.2 25.37,16.99 v25.2,17.56 | R29.1 C25.1 | C40.1 10.87,20.76 10.67,20.06 9.47,20.06 | 9.47,20.06 v9.17,19.76 8.57,19.16 JP5.5 JP5.6 | 9.47,20.06 9.42,20.06 C42.2 | C38.1 59.17,5.08 | C19.2 7.63,3.82 7.77,3.86 v8.07,5.16 8.17,5.16 8.59,6.48 9.09,6.59 | v38.77,5.16 38.59,5.26 | C22.1 34,41.49 | C27.2 41.13,32.23 41.51,32.71 | SJ8.3 36.05,27.54 36.47,27.96 41.87,27.96 | C49.1 41.87,26.56 | C48.1 41.87,22.36 | C51.2 24.82,24.51 26.97,23.76 26.97,19.46 25.37,17.66 25.3,17.56 v25.2,17.56 | C50.2 34.52,17.51 36.07,17.46 37.22,17.46 v37.96,17.32 | C41.2 25.17,17.59
  Top 0.61: POWER.7 POWER.6
  Bottom 0.254: 8.12,5.21 v8.07,5.16
  Bottom 0.406: v58.75,14.59 v47.4,14.59 | U$7.5 22.86,49.33 20.29,48.86 16.51,49.16 15.24,49.53 U$7.2 | v41.5,20.43 40.4,19.79 36.43,19.79 v37.96,17.32 | v38.77,5.16 38.67,6.46 8.57,6.46 v8.07,5.16
  Bottom 0.813: v47.4,14.59 47.3,15.57 38.46,15.57 v37.96,17.32 36.47,19.22 36.07,19.96 | 36.47,19.56 36.07,19.96 | 36.07,19.96 24.77,19.96 | v9.17,19.76 10.27,20.06 25.27,20.06 25.27,17.53 v25.2,17.56
  other vias: 79.97,12.66 79.27,10.76 32.87,28.16
  pour Top: 0,53.34 0,0 81.28,0 81.28,53.34
  pour Bottom: 0,41.91 0,0 81.28,0 81.28,53.34 0,53.34
N$1  (via drill 0.5)
  Top 0.254: C4.2 61.15,24.34 v63.97,24.86 65.67,25.46 73.07,25.46 73.07,28.36 R18.2 | SJ2.2 v66.47,8.16 | v65.27,12.06 65.27,17.06 63.97,18.06 v63.97,18.66
  Bottom 0.254: v63.97,24.86 v63.97,18.66 | v65.27,12.06 65.27,9.96 v66.47,8.16
N$2
  Top 0.254: IC3.7 54.61,19.45 56.58,19.48 56.58,17.96 C34.2 R8.1 56.68,14.43
  Top 0.406: R10.1 58.24,12.64 56.94,13.69 56.86,14.54 R8.1 | 56.86,14.15 56.68,14.43
N$3
  Top 0.254: R7.2 49.85,15.64 49.87,15.86 51.67,15.86 51.67,17.21 C47.2
N$5  (via drill 0.5)  (1 unrouted)
  Top 0.254: v32.25,29.38 C15.2 30.57,29.2 30.57,28.76 30.47,28.76 29.79,28.08 29.79,26.81 | v35.39,30.68 R3.1
  Bottom 0.254: v32.25,29.38 v35.39,30.68
N$6
  Top 0.254: C24.1 R23.1 16.71,20.88 IC2.2 16.71,24.37 15.94,27.74 13.47,27.76 11.67,27.76 11.47,27.84 R27.2
N$7
  Top 0.254: R1.1 53.27,35.36 54.67,35.36 54.67,33.26 54.77,33.16 54.77,33.71 C33.1 54.83,30.96 R2.2 53.67,30.86 53.27,30.46 53.27,26.8 IC3.9
N$8
  Top 0.254: IC3.6 53.34,17.79 53.37,17.76 54.84,17.76 C34.1 R8.2 52.44,14.83 R7.1
N$9  (via drill 0.5)
  Top 0.254: U$4.2 68.25,26.31 68.21,26.18 v63.54,26.18 | D3.C 61.15,28.12 v61.22,27.78 R9.2
  Bottom 0.254: v63.54,26.18 v61.22,27.78
N$10
  Top 0.254: R21.2 72.99,9.78 | 72.99,9.78 C10.2 | 72.99,9.78 72.99,8.48 72.07,8.36 SJ3.2
N$12
  Top 0.254: 63.79,16.13 63.79,12.62 R10.2 | U$5.2 68,9.99 63.77,9.99 63.77,11.46 63.79,16.13 | 63.79,16.13 D1.C
N$13  (via drill 0.5)
  Top 0.254: v2.81,27.11 R24.1 C28.1 6.97,28.9 R27.1
  Bottom 0.254: v2.81,27.11 2.81,34.53 v13.5,34.53 17.15,34.53 IC2.6
N$14  (via drill 0.5)
  Top 0.254: IC3.12 v49.13,30.68 | R3.2 v40.91,30.68 40.97,30.64 | v32.87,34.96 31.07,34.96 31.06,34.96 29.99,34.89 U$1.7
  Bottom 0.254: v49.13,30.68 v40.91,30.68 40.97,30.72 40.87,32.26 40.27,32.86 33.27,32.86 32.87,33.26 v32.87,34.96
N$15  (via drill 0.5)
  Top 0.254: R22.2 52.77,46.76 | 51.67,46.96 52.77,46.76 | 52.77,46.76 52.77,45.36 53.27,45.07 R20.1 54.07,44.94 51.27,42.26 v45.57,42.26 | RXD.1 36.98,36.67 38.57,38.86 40.87,38.86 v41.57,38.56
  Bottom 0.254: v45.57,42.26 v41.57,38.56
N$16  (via drill 0.5)
  Top 0.254: IC2.1 14.17,20.88 R23.2 14.17,20.56 14.17,18.02 | C24.2 14.17,18.02 | v20.93,25.17 21.07,25.56 21.07,28.88 24.07,28.88 24.07,29.86 25.57,31.36 25.57,35.36 25.39,35.54 U$1.1 | 14.17,18.02 14.17,16.96 14.37,16.76 18.37,16.76 18.47,17.26 SJ12.1
  Bottom 0.254: v20.93,25.17 14.17,25.17 IC2.1
N$17
  Top 0.254: U$1.6 27.95,34.24 27.47,33.96 27.47,29.76 27.57,29.36 28.47,29.36 C15.1 29.01,28.2 29.14,28.06 IC1.7
N$18
  Top 0.254: U$2.6 30.69,9.74 30.47,10.16 30.47,14.16 28.27,15.76 28.27,17.29 28.2,17.66 C11.1 28.13,19.36 28.49,19.72 IC1.1
N$19  (via drill 0.5)
  Top 0.254: v35.35,18.68 R4.1 | v31.41,18.68 C11.2 29.7,19.2 29.17,20.03 29.17,20.26 29.14,20.29 IC1.2
  Bottom 0.254: v31.41,18.68 v35.35,18.68
N$20  (1 unrouted)
  Top 0.254: IC3.13 48.26,29.95 46.57,29.95 46.57,32.66 R16.2 46.97,36.06 | 46.67,36.46 46.67,36.56 46.97,36.96 47.17,36.96 46.87,36.86 46.97,36.92 C35.1 | R15.1 46.93,36.1 46.97,36.06 | 46.97,36.06 46.97,36.26
N$21
  Top 0.254: R5.1 23.34,34.2 24.08,34.24 U$1.3
N$22  (via drill 0.5)
  Top 0.254: R11.2 C16.2 9.61,35.89 v9.89,37.04 | C1.2 v15.44,37.07 15.53,37.16 18.67,37.16 18.87,36.96 SJ13.2
  Bottom 0.254: v9.89,37.04 14.47,37.04 v15.44,37.07 16.89,37.07 19.57,34.56 20.41,33.42 IC2.5
N$24  (via drill 0.5)
  Top 0.254: U$1.4 23.8,33.19 23.67,32.66 23.47,32.26 18.77,32.26 | 18.77,32.26 17.77,31.96 17.07,31.66 17.07,31.08 IC2.7 | SJ13.1 18.87,32.56 18.77,32.26 | R24.2 C28.2 | C28.2 9.21,30.8 v9.87,30.96
  Top 0.406: C28.2
  Bottom 0.254: IC2.7 16.17,31.26 15.97,32.16 9.87,32.16 v9.87,30.96
N$25  (via drill 0.5)
  Top 0.254: v8.25,8 7.33,6.58 R14.2 6.73,5.37 5.91,5.15 5.01,5.1 C19.1 | IC4.3 C5.1 19.43,5.32 SJ14.2
  Bottom 0.254: v8.25,8 10.78,10 18.85,10.03 IC4.3
N$26  (via drill 0.5)
  Top 0.254: K2.4 76.38,47.25 77.47,47.16 77.47,41.66 76.52,40.46 75.77,40.46 | C13.2 75.77,40.46 | 75.77,40.46 75.77,36.86 74.77,35.06 v74.77,26.56
  Bottom 0.254: v74.77,26.56 74.77,24.56 77.07,22.26 78.27,21.36 78.67,20.66 78.87,20.17 S2.4
N$27  (via drill 0.5)
  Top 0.254: IC3.14 46.99,29.11 45.15,29.11 v45.15,32.12 45.05,33 | C35.2 45.19,36.58 45.17,36.76 44.97,36.76 45.07,36.66 R16.1 | C46.1 49.82,32.91 v48.13,32.12
  Top 0.406: 45.05,33 44.97,33.9 R16.1 44.85,33.66
  Bottom 0.254: v45.15,32.12 v48.13,32.12
N$28
  Top 0.406: SJ17.2 5.21,24.77 JP5.10 JP5.8
N$29  (via drill 0.5)
  Top 0.254: v11.33,1.94 11.31,2.26 R13.2 C18.2 11.63,6.91 11.63,9.13 13,10.1 17.55,10.1 17.57,12.56 18.39,13.14 19.65,13.14 IC4.5 21.87,15.56 SJ15.2 | v19.25,2.21 C5.2
  Bottom 0.254: v11.33,1.94 17.55,1.94 v19.25,2.21
N$30
  Top 0.254: IC3.2 48.16,19.65 46.99,19.65 45.99,17.96 C36.1 R19.2
  Top 0.406: R17.1 R19.2
N$32  (via drill 0.5)
  Top 0.254: IC3.1 45.78,20.42 45.12,19.42 44.77,18.73 v44.07,18.06 C36.2 R19.1 | C47.1 48.07,17.26 v47.67,18.06
  Bottom 0.254: v47.67,18.06 v44.07,18.06
N$33  (via drill 0.5)
  Top 0.406: R20.2 54.17,47.82 v55.94,48.16 | v73.66,48.16 IOL.2
  Bottom 0.406: v55.94,48.16 v73.66,48.16
N$34
  Top 0.254: R5.2 22.23,35.36 22.61,34.89 U$1.2
N$35  (via drill 0.5)
  Top 0.254: v48.07,41.16 v51.97,41.16
  Bottom 0.254: TXD.1 39.44,36.83 43.37,36.86 v48.07,41.16 | v51.97,41.16 57.47,41.16 58.97,42.96 59.27,44.36 59.87,46.76 76.17,46.76 76.17,50.77 IOL.1
N$36
  Top 0.254: IC3.8 54.61,29.35 56.87,29.36 57.37,29.36 57.37,27.75 R9.1 57.33,30.65 R2.1 56.73,30.96 C33.2
N$37  (via drill 0.5)
  Top 0.254: v4.17,32.93 R12.1
  Bottom 0.406: JP5.7 8.77,22.96 8.77,31.36 7.57,32.96 v4.17,32.93
N$38
  Top 0.254: SJ2.1 64.85,5.09 AD.1
N$39  (via drill 0.5)
  Top 0.254: U$4.1 65.57,28.26 65.07,28.76 v63.57,28.76 | v63.57,32.36 63.57,37.56 v70.07,37.56 70.12,38 70.12,38.84 C2.2 | v70.17,35.46 69.67,35.26 69.57,34.76 | 69.57,34.76 69.57,33.7 U$4.6 69.51,34.7 69.57,34.76
  Bottom 0.254: v63.57,32.36 v63.57,28.76 | v70.07,37.56 70.07,35.86 v70.17,35.46
N$40  (via drill 0.5)
  Top 0.254: C29.1 R25.1 16.39,7.54 IC4.2 16.71,9.53 18.62,9.53 19.49,11.5 v19.49,11.84 | R28.2 4.95,10.24 v8.12,10.31
  Bottom 0.254: v19.49,11.84 19.22,11.91 18.87,12.06 8.87,12.06 8.87,10.41 v8.12,10.31
N$41
  Top 0.254: U$5.1 66.74,13.6 66.97,14.44 67.24,14.64 69.07,14.67 U$5.6 69.47,18.96 70.07,18.96 71.37,18.96 71.47,19.66 71.47,23.18 70.14,23.19 70.14,23.76 C3.2
N$42  (via drill 0.5)
  Top 0.254: v8.96,16.92 9.41,16.77 C30.1 R26.1 9.41,9.34 R28.1
  Bottom 0.254: v8.96,16.92 v8.97,16.92 8.97,17.26 11.87,17.26 19.11,17.24 IC4.6
N$43
  Top 0.254: IC4.1 14.17,5.64 R25.2 C29.2 14.47,2.16 14.97,1.34 22.99,1.34 23.3,3.86 | 23.3,3.86 23.3,5.75 23.91,6.26 28.07,6.26 29.27,6.66 29.27,10.86 28.79,11.04 U$2.1 | SJ14.1 23.16,3.8 23.3,3.86
N$44
  Top 0.254: U$2.2 26.34,10.39 25.77,10.96 25.53,10.96 R6.2
N$45  (via drill 0.5)
  Top 0.254: R26.2 C30.2 11.31,14.53 12.9,12.94 16.71,12.94 | 16.71,12.94 16.71,14.06 | 16.71,14.06 IC4.7 | v16.71,11.07 16.71,12.94 | U$2.4 27.8,9.09 27.47,8.26 27.07,7.86 26.57,7.46 23.47,7.46 23.47,10.7 v23.1,11.07 | SJ15.1 20.83,20.22 20.07,20.16 19.97,20.16 19.97,17.36 20.57,15.26 19.37,13.76 17.01,13.76 16.71,14.06
  Bottom 0.254: v16.71,11.07 v23.1,11.07
N$46
  Top 0.254: U$4.5 70.77,32.46 71.57,30.98 R18.1
N$47
  Top 0.254: SJ3.1 69.77,4.76 66.67,4.76 66.27,3.21 AD.2
N$48  (via drill 0.5)
  Top 0.254: SJ2.3 67.99,7.88 68.07,7.96 v68.87,7.96
  Bottom 0.254: v68.87,7.96 68.87,3.13 AD.3
N$49
  Top 0.254: SJ3.3 73.49,5.08 71.07,5.06 71.07,2.59 AD.4
N$50  (via drill 0.5)
  Top 0.254: v40.97,18.56 40.97,14.66 31.17,14.66 31.17,11.76 31.17,10.96 31.17,10.65 31.27,10.46 31.44,10.39 U$2.7 | v40.97,18.56 39.23,18.46 R4.2 40.25,18.48 v40.97,18.56 | 49.75,19.74 v49.77,19.76 49.47,20.66 49.37,20.76 49.37,21.37 IC3.3
  Bottom 0.254: v49.77,19.76 42.27,19.76 v40.97,18.56
N$51
  Top 0.254: IC6.4 57.42,6.91 57.77,7.26 57.77,8.66 59.02,8.66 C38.2
N$52
  Top 0.406: SJ6.2 5.21,13.55 JP5.2 4.66,14.06 2.37,14.06 1.47,15.46 1.47,34.26 2.01,35.3 R11.1
N$53
  Top 0.254: 67.41,46.79 R33.2 67.51,48.21 67.61,48.26 71.05,48.26 71.12,49.53 IOL.3
N$54
  Top 0.254: U$2.3 26.35,9.74 25.77,9.16 25.65,9.26 R6.1
N$55
  Top 0.254: C17.1 R12.2 | SJ12.2 19.27,23.08 IC2.3
  Top 0.406: C1.1 12.23,31.52 10.83,31.41 | 10.83,31.41 9.56,32.91 C17.1 | IC2.3 19.27,23.1 17.57,25.16 16.77,28.56 12.35,28.54 12.38,31.31 10.83,31.41
N$56
  Top 0.254: 34.37,46.66 34.47,46.66 34.37,46.76 34.47,46.76 R38.2 34.47,46.71
  Top 0.406: IC7.1 38.67,45.51 | 38.67,45.51 34.47,46.71 | 39.07,43.26 39.12,43.26 | 39.12,43.26 IC7.3 40.37,43.01 C14.2 | 39.12,43.26 38.67,43.36 38.67,45.51
N$57
  Top 0.254: U$5.5 70.84,15.88 71.07,15.76 72.17,15.66 72.17,13.76 74.77,13.76 75.27,13.46 75.27,11.81 R21.1
N$59
  Top 0.254: 50.97,9.01 D2.C | 53.77,8.81 IC6.1
  Top 0.406: C37.2 50.97,9.01 | D2.C 52.57,8.71 | 52.57,8.71 53.77,8.81 | IC6.3 52.92,6.91 52.57,7.06 52.57,8.71
N$65  (via drill 0.5)
  Top 0.254: v3.27,47.46 2.47,49.26 1.67,49.36 | v53.17,23.86 52.17,22.96 52.17,21.63 | 52.17,21.56 52.17,21.63 | 52.17,21.63 IC3.5 | SJ7.1 40.15,22.08 v40.77,22.16 | R34.2 1.67,49.36 | SJ11.2 2.87,49.06 2.57,49.36 1.67,49.36
  Top 0.406: C31.2 v15.07,46.36
  Bottom 0.254: v3.27,47.46 4.47,46.36 v15.07,46.36 17.27,46.66 21.67,46.66 23.07,47.26 49.77,47.36 50.77,45.96 50.77,37.96 51.77,37.96 51.77,25.66 v53.17,23.86 53.17,22.06 44.27,22.16 v40.77,22.16
N$74
  Top 0.254: R33.1 69.25,47.39 K2.1 73.17,47.36 73.57,46.26 73.57,44.86 73.21,44.39 K1.1
N$75
  Top 0.254: 5.72,51.36 R34.3 | 6.97,46.16 5.72,46.16 R35.3
  Top 0.406: 5.72,51.36 7.87,51.36 8.67,50.56 R39.2 7.52,49.31 7.37,48.96 7.37,46.56 6.97,46.16 | R35.3 8.82,46.11 10.37,46.16 11.87,45.11 C25.2
N$77
  Top 0.406: SJ6.1 6.73,13.59 JP5.1 JP5.3
N$78  (via drill 0.5)
  Top 0.254: IC5.7 58.63,44.23 56.57,44.16 56.17,42.66 56.12,40.26 R36.1 56.17,40.16 56.17,36.96 v58.67,35.96 58.57,35.96 | 74.87,37.56 74.77,37.66 74.82,37.71 74.87,37.56 | 74.87,37.71 74.87,37.61 | v73.57,36.16 74.27,36.76 74.67,37.06 74.87,37.56 | 74.87,37.56 74.87,37.61 | 74.87,37.61 R37.2
  Bottom 0.254: v73.57,36.16 73.27,39.06 68.27,39.06 68.27,40.46 61.07,40.46 61.07,35.96 v58.67,35.96
N$80  (via drill 0.5)  (1 unrouted)
  Top 0.254: R37.1 72.17,38.06 72.12,40.51 | 72.12,40.51 72.07,40.46 | 72.07,40.46 71.87,40.46 | 71.87,40.46 v71.07,40.46 | 58.77,40.06 58.87,40.12 | 58.87,40.12 IC5.2 58.71,42.42 58.87,42.76 59.17,43.06 59.87,43.26 59.87,45.7 IC5.6 | C6.2 70.97,41.66 71.02,40.51 | 71.02,40.51 71.07,40.56 72.12,40.51 | C13.1 72.07,40.46 | 71.87,40.46 71.02,40.51 | v70.37,20.96 70.37,21.16 68.69,21.16 | 58.87,40.12 58.77,39.96 v58.77,38.86
  Bottom 0.254: v71.07,40.46 69.87,41.16 59.57,41.16 v58.77,38.86 58.67,38.96 57.27,38.96 56.67,37.96 56.77,18.16 57.37,17.36 70.27,17.36 70.37,17.86 v70.37,20.96
N$81  (via drill 0.5)
  Top 0.406: R13.1 9.41,2.4 8.37,1.96 3.37,1.96 v1.67,2.56 | SJ17.1 6.73,24.73 JP5.9
  Bottom 0.406: v1.67,2.56 1.67,25.26 3.87,26.06 5,26.06 JP5.9
N$82
  Top 0.254: 45.82,44.96 C32.1
  Top 0.406: IC7.4 44.02,44.01 44.77,44.96 45.82,44.96
N$83  (via drill 0.5)
  Top 0.254: IC5.5 v62.07,45.46 | v70.77,44.56 69.32,43.96 C7.2
  Bottom 0.254: v70.77,44.56 69.97,45.46 v62.07,45.46
N$84
  Top 0.254: 54.27,11.16 SJ1.3 54.77,11.16 54.77,10.86 55.17,10.76 55.17,10.66 55.07,10.76 | 57.07,10.76 56.97,10.66 | 56.57,8.91 IC6.5
  Top 0.406: SJ1.3 56.49,11.29 IC6.5 | C39.2 61.47,9.56 61.07,10.76 57.07,10.76 | 56.97,10.66 56.57,8.91
N$85  (via drill 0.5)
  Top 0.254: SJ1.1 51.17,11.16 51.37,11.16
  Top 0.406: 51.37,11.16 v49.57,11.16
  Bottom 0.406: v49.57,11.16 49.97,10.27 49.97,5.44 POWER.5
N$90
  Top 0.254: R29.2 5.87,44.01 R35.1 4.32,43.81 4.17,44.26 | 4.17,44.26 4.17,48.06 4.3,48.3 | 4.3,48.3 4.57,48.76 5.52,48.76 R34.1 | 4.17,44.26 4.17,44.12 SJ10.1 | SJ11.1 4.43,48.42 4.3,48.3
N$91
  Top 0.254: U$4.8 66.97,36.05 SJ5.2
N$92
  Top 0.254: U$5.8 67.03,21.02 SJ4.2
N$93  (via drill 0.5)
  other vias: 6.57,39.16
N$94
  Top 0.254: SJ9.1 63.17,42.86 62.07,42.86 62.07,39.06 60.47,39.06 59.77,39.76 59.77,40.73 IC5.3
N$95  (via drill 0.5)
  Top 0.254: C44.1 C45.2 | C44.1 73.37,20.66 73.47,20.56 | SJ5.3 67.99,36.44 67.97,36.46 70.57,36.46 73.47,34.06 v73.47,31.46 | v73.27,18.86 73.27,19.21 C44.1
  Bottom 0.254: v73.27,18.86 72.77,19.16 72.67,19.26 72.67,26.96 73.47,28.56 v73.47,31.46
N$96  (via drill 0.5)
  other vias: 6.57,40.46
N$97  (via drill 0.5)
  Top 0.254: K1.4 75.91,44.39 75.87,44.26 v75.57,44.16 | v73.67,23.86 73.47,22.81 C44.2
  Bottom 0.254: v75.57,44.16 75.57,34.26 75.47,34.06 75.47,33.96 74.57,32.76 74.57,28.16 73.87,26.96 73.87,24.26 v73.67,23.86 73.97,23.76 74.47,23.46 | 74.47,23.36 74.47,23.46 | 74.47,23.46 74.77,23.06 75.77,21.66 75.97,21.46 76.46,19.96 S2.1
N$98  (via drill 0.5)
  other vias: 6.57,41.76
N$99
  Top 0.254: R31.2 4.37,38.66 1.47,38.66 1.27,38.86 1.27,39.41 R41.1
N$100
  Top 0.254: R30.2 2.77,41.76 2.87,41.86 4.32,41.86 R32.2
N$101
  Top 0.254: R40.2 4.37,40.26 3.77,40.16 3.12,39.56 R30.1
N$102
  Top 0.254: R1.2 49.75,35.38 49.97,35.16 51.67,35.16 51.87,34.96 51.87,33.71 C46.2
N$103  (via drill 0.5)
  Top 0.406: D2.A 51.17,6.26 51.37,6.06 v52.27,6.06
  Bottom 0.254: 58.17,5.96 58.27,5.86 | 58.37,2.59 POWER.8
  Bottom 0.406: v52.27,6.06 57.97,6.06 58.17,5.96 | 58.27,5.86 58.37,5.26 58.37,2.59
N$104
  Top 0.254: SJ8.2 37.57,24.76 37.27,24.46 31.07,24.46 30.47,25.06 30.47,26.2 IC1.5
N$107  (via drill 0.5)
  Top 0.254: v51.57,24.06 52.07,25.36 IC3.10 52.07,30.26 v50.17,31.96 | v40.77,24.36 40.09,25.56 SJ8.1 | v2.37,46.76 1.67,46.76 R35.2 1.81,44.96 SJ10.2 | C12.2 v18.58,45.65 v18.57,45.66
  Bottom 0.254: v51.57,24.06 51.57,23.76 51.27,23.76 40.77,23.76 v40.77,24.36 | v50.17,31.96 49.77,31.96 49.77,45.36 49.07,46.66 23.97,46.66 22.97,45.66 v18.57,45.66 17.07,45.66 17.07,45.06 3.87,45.06 3.87,45.66 v2.37,46.76
N$108
  Top 0.254: IC1.3 29.79,23.38 30.07,23.66 37.47,23.66 37.57,23.56 SJ7.2
N$109  (via drill 0.5)
  Top 0.254: SJ4.1 65.75,21.88 65.47,22.16 v65.47,22.36 | v65.47,32.36 65.47,35.64 SJ5.1 | SJ9.2 65.97,45.36 65.97,40.86 v64.77,39.46
  Bottom 0.254: v65.47,22.36 v65.47,32.36 64.17,33.66 64.17,38.96 64.37,39.06 v64.77,39.46
N$113
  Top 0.254: IOL.4 68.58,50.07 67.57,49.06 67.07,49.06 66.27,48.26 65.07,48.26 64.87,48.06 SJ9.3
N$114  (via drill 0.5)  (1 unrouted)
  Top 0.406: R14.1 3.64,6.59 3.17,7.06 v3.17,7.66
  Bottom 0.406: 4.62,16.56 3.87,16.56 3.17,15.86 v3.17,7.66
N$119
  Top 0.406: C32.2 44.17,46.91 IC7.5 42.67,45.71 42.67,46.16 42.57,46.56 SJ16.2
V+  (via drill 0.5)  (1 unrouted)
  Top 0.254: 25.46,50.86 U$7.6 | C48.2 44.67,22.46 44.67,23.46 | U$1.8 29.25,35.54
  Top 0.406: U$7.6 26.67,50.8 27.94,49.53 27.94,44.45 | 27.94,44.45 C9.1 | v38.47,35.66 38.37,35.16 34.39,35.16 34.39,36.14 33.94,36.59 32.1,36.59 | 27.94,44.45 29.91,44.45 | 29.91,44.45 v29.97,43.15 29.85,43.45 | C23.2 v35.28,12.13 | 29.91,44.45 29.91,43.52 29.87,43.46 | v42.87,35.46 v42.87,28.36 | IC3.4 50.8,23.13 50.47,23.56 44.67,23.56 | 44.67,23.56 v44.67,24.76 | v26.77,28.56 26.77,36.26 29.87,36.26 | v26.77,28.56 25.17,27.16 | 25.17,27.16 26.76,28.56 | R38.1 31.07,47.46 27.57,50.86 25.46,50.86 | 12.27,17.56 v12.27,26.26 11.47,26.26 10.87,25.96 C40.2 | 12.27,17.56 12.27,17.38 IC4.8 | C42.1 11.72,18.11 12.27,17.56 | v35.28,12.13 35.18,11.97 35.17,13.46 42.37,13.46 42.47,18.36 43.77,19.36 44.57,19.86 44.67,23.56 | 44.67,23.46 44.67,23.56 | 25.17,27.16 25.27,26.96 C51.1 | 29.25,35.54 29.97,36.26 | U$2.8 34.75,11.04 35.27,11.36 v35.27,12.12 v35.28,12.13 | 29.97,36.26 31.97,36.26 32.1,36.59 | 29.97,36.26 29.87,36.26 | 29.87,36.26 29.87,40 v29.91,40.04 | C22.2 32.1,36.59 | IC1.8 28.49,27.34 28.27,27.56 27.47,27.56 27.17,28.16 v26.77,28.56
  Bottom 0.254: 14.2,15.45 IC4.8 | 42.87,35.66 v42.87,35.46
  Bottom 0.406: v29.91,40.04 29.91,41.99 v29.97,43.15 | v38.47,35.66 42.87,35.66 | v26.77,28.56 14.87,28.56 14.07,29.06 14.07,30.62 12.33,30.62 12.37,29.56 v12.27,26.26 | v44.67,24.76 44.67,28.26 v42.87,28.36
V-  (via drill 0.5)
  Top 0.254: 36.58,8.62 C21.1 36.6,9.09 | v34.14,29 34.17,28.97 34.07,29.06 | 50.77,26.7 IC3.11
  Top 0.406: 21.34,12.85 23.43,14.23 23.43,22.43 IC2.4 24.52,22.57 C41.1 | 21.34,12.85 21.27,12.46 21.27,9.26 IC4.4 | IC3.11 v50.4,29.21 | 23.23,45.62 23.16,46.02 20.32,48.26 U$7.4 | 23.23,45.62 v24.7,45.59 | C8.2 23.23,45.62 | v34.14,29 34.14,31.01 32.22,31.01 32.13,31.5 C27.1 32.13,33.3 31.57,33.86 | 32.38,19.65 32.38,17.01 32.45,16.44 v36.59,16.44 | 36.58,8.62 36.58,8.58 v36.59,10.49 | C43.1 22.7,12.81 21.34,12.85 | v39.94,37.9 40,37.83 40.27,37.76 40.27,34.46 39.97,33.86 31.57,33.86 | 31.57,33.86 30.34,33.66 29.51,33.59 U$1.5 | v34.17,21.76 34.17,21.86 33.59,21.28 32.89,21.28 32.27,20.66 32.27,19.76 | C49.2 45.72,26.21 45.87,24.76 50.27,24.76 50.77,25.26 50.77,26.7 | 33.77,19.35 C50.1 33.21,19.25 32.38,19.65 | U$2.5 36.6,9.09 | IC1.4 30.54,19.99 32.27,19.76 | 32.27,19.76 32.38,19.65
  Bottom 0.254: 34.17,27.77 v34.14,29
  Bottom 0.406: v36.59,16.44 v36.59,10.49 | IC2.4 34.17,23.06 | v50.4,29.21 34.1,29.21 34.16,28.66 34.16,28.72 v34.14,29 34.17,28.6 34.17,27.77 34.17,23.06 | v39.94,37.9 39.94,45.29 38.17,45.96 25.33,45.96 v24.7,45.59 | v34.17,21.76 34.17,23.06
VCC  (via drill 0.5)  (1 unrouted)
  Top 0.254: U$4.7 68.25,31.49 | U$4.4 70.78,27.68 | 61.17,42.06 IC5.4 | 57.37,46.36 57.37,46.46 | 57.47,46.56 57.47,46.26 | 68.25,31.48 68.37,31.36 v68.57,31.36 | R41.2 1.42,42.31 | 53.07,11.16 SJ1.2 | 70.5,26.56 v70.52,26.58 | 70.58,11.64 70.58,9.97 v70.72,9.83 | U$5.7 68,18.11
  Top 0.406: v68.27,18.82 68.21,18.61 68,18.11 | U$5.4 70.58,11.64 | 68.25,31.49 69.38,31.16 70.45,31.16 70.78,30.23 U$4.4 | 70.78,27.68 v70.52,26.58 | v48.67,39.36 v53.27,39.36 53.27,42.96 54.82,42.91 R36.2 55.97,45.06 57.47,45.06 57.47,46.26 57.37,46.46 57.47,46.56 | 61.17,42.06 v61.17,43.86 63.07,43.86 63.07,47.56 62.17,47.96 57.47,47.96 57.37,46.95 57.37,46.36 IC5.8 | U$4.7 68.25,31.48 | C20.2 35.91,44.83 VCC.1 | v20.85,44.35 20.88,45.75 18.07,47.76 16.27,48.16 14.17,48.16 U$7.1 | 1.42,42.31 v1.47,42.26 | SJ1.2 53.17,13.06 v53.37,13.26
  Bottom 0.254: v74.57,42.06 74.37,42.16 74.57,42.16 | U$7.1 12.7,50.83 | 70.47,26.53 v70.52,26.58 | 70.57,26.56 69.17,25.96 68.27,25.06 v68.27,18.82
  Bottom 0.406: v20.85,44.35 20.87,44.36 25.17,44.36 29.17,44.55 34.29,44.55 | 34.29,44.55 34.29,34.19 45.17,34.26 45.17,34.29 45.21,35.99 46.48,37.26 v48.67,39.36 | VCC.1 34.29,44.55 | v53.27,39.36 53.24,39.46 53.24,39.44 | v74.57,42.06 62.27,42.06 v61.17,43.86 | v68.57,31.36 72.07,31.36 v72.07,33.46 74.57,34.56 v74.57,42.06 | 74.57,42.16 v74.57,42.06 | 12.7,50.83 11.07,51.96 2.57,51.96 2.07,51.86 1.47,51.26 v1.47,42.26 | v53.37,13.26 69.59,13.36 v70.72,9.83 70.77,10.58 71.27,10.76 71.67,11.36 71.67,24.36 70.47,25.66 70.47,26.53
VEE  (via drill 0.5)
  Top 0.254: 8.63,47.47 R39.1
  Top 0.406: R39.1 11.72,47.51 11.82,47.71 v12.17,48.06 | C26.2 48.33,47.8 47.57,48.56 40.91,48.56 SJ16.1 37.61,48.12 36.87,48.96 36.87,50.76 IOH.8
  Bottom 0.406: v12.17,48.06 12.37,48.36 15.77,48.36 20.07,47.96 23.37,48.56 34.87,48.66 35.97,48.76 36.83,49.62 IOH.8

### Text on the board
Bottom: brain-duino V0.2-Feb2015 | mkahata